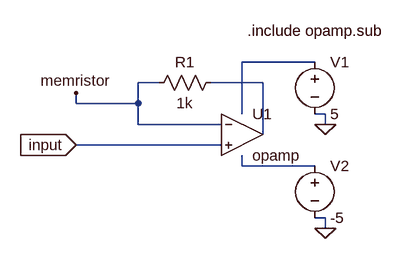
[diagram p0: schematic programmer_block.asc]
programmer_block.asc, the LTspice schematic file:
Version 4
SHEET 1 880 680
WIRE 288 16 176 16
WIRE 48 48 16 48
WIRE 208 48 128 48
WIRE -80 80 -80 64
WIRE 16 80 16 48
WIRE 16 80 -80 80
WIRE 176 96 176 16
WIRE 304 96 288 96
WIRE 16 112 16 80
WIRE 144 112 16 112
WIRE 304 112 304 96
WIRE 208 128 208 48
WIRE 144 144 -80 144
WIRE 176 176 176 160
WIRE 288 176 176 176
WIRE 304 256 288 256
WIRE 304 272 304 256
FLAG 304 112 0
FLAG 304 272 0
FLAG -80 64 memristor
FLAG -80 144 input
IOPIN -80 144 In
SYMBOL voltage 288 0 R0
WINDOW 123 0 0 Left 2
WINDOW 39 0 0 Left 2
SYMATTR InstName V1
SYMATTR Value 5
SYMBOL voltage 288 160 R0
WINDOW 123 0 0 Left 2
WINDOW 39 0 0 Left 2
SYMATTR InstName V2
SYMATTR Value -5
SYMBOL res 144 32 R90
WINDOW 0 0 56 VBottom 2
WINDOW 3 32 56 VTop 2
SYMATTR InstName R1
SYMATTR Value 1k
SYMBOL Opamps\\opamp 176 64 R0
SYMATTR InstName U1
TEXT 184 -32 Left 2 !.include opamp.sub

The netlist it stands for:
* programmer_block.asc
V1 N001 0 5
V2 N003 0 -5
R1 N002 memristor 1k
XU1 memristor input N002 opamp Aol=100K GBW=10Meg  ; pins invin noninvin out
.include opamp.sub
.backanno
.end